# EAGLE design source_eagle (EAGLE 9.6.2)
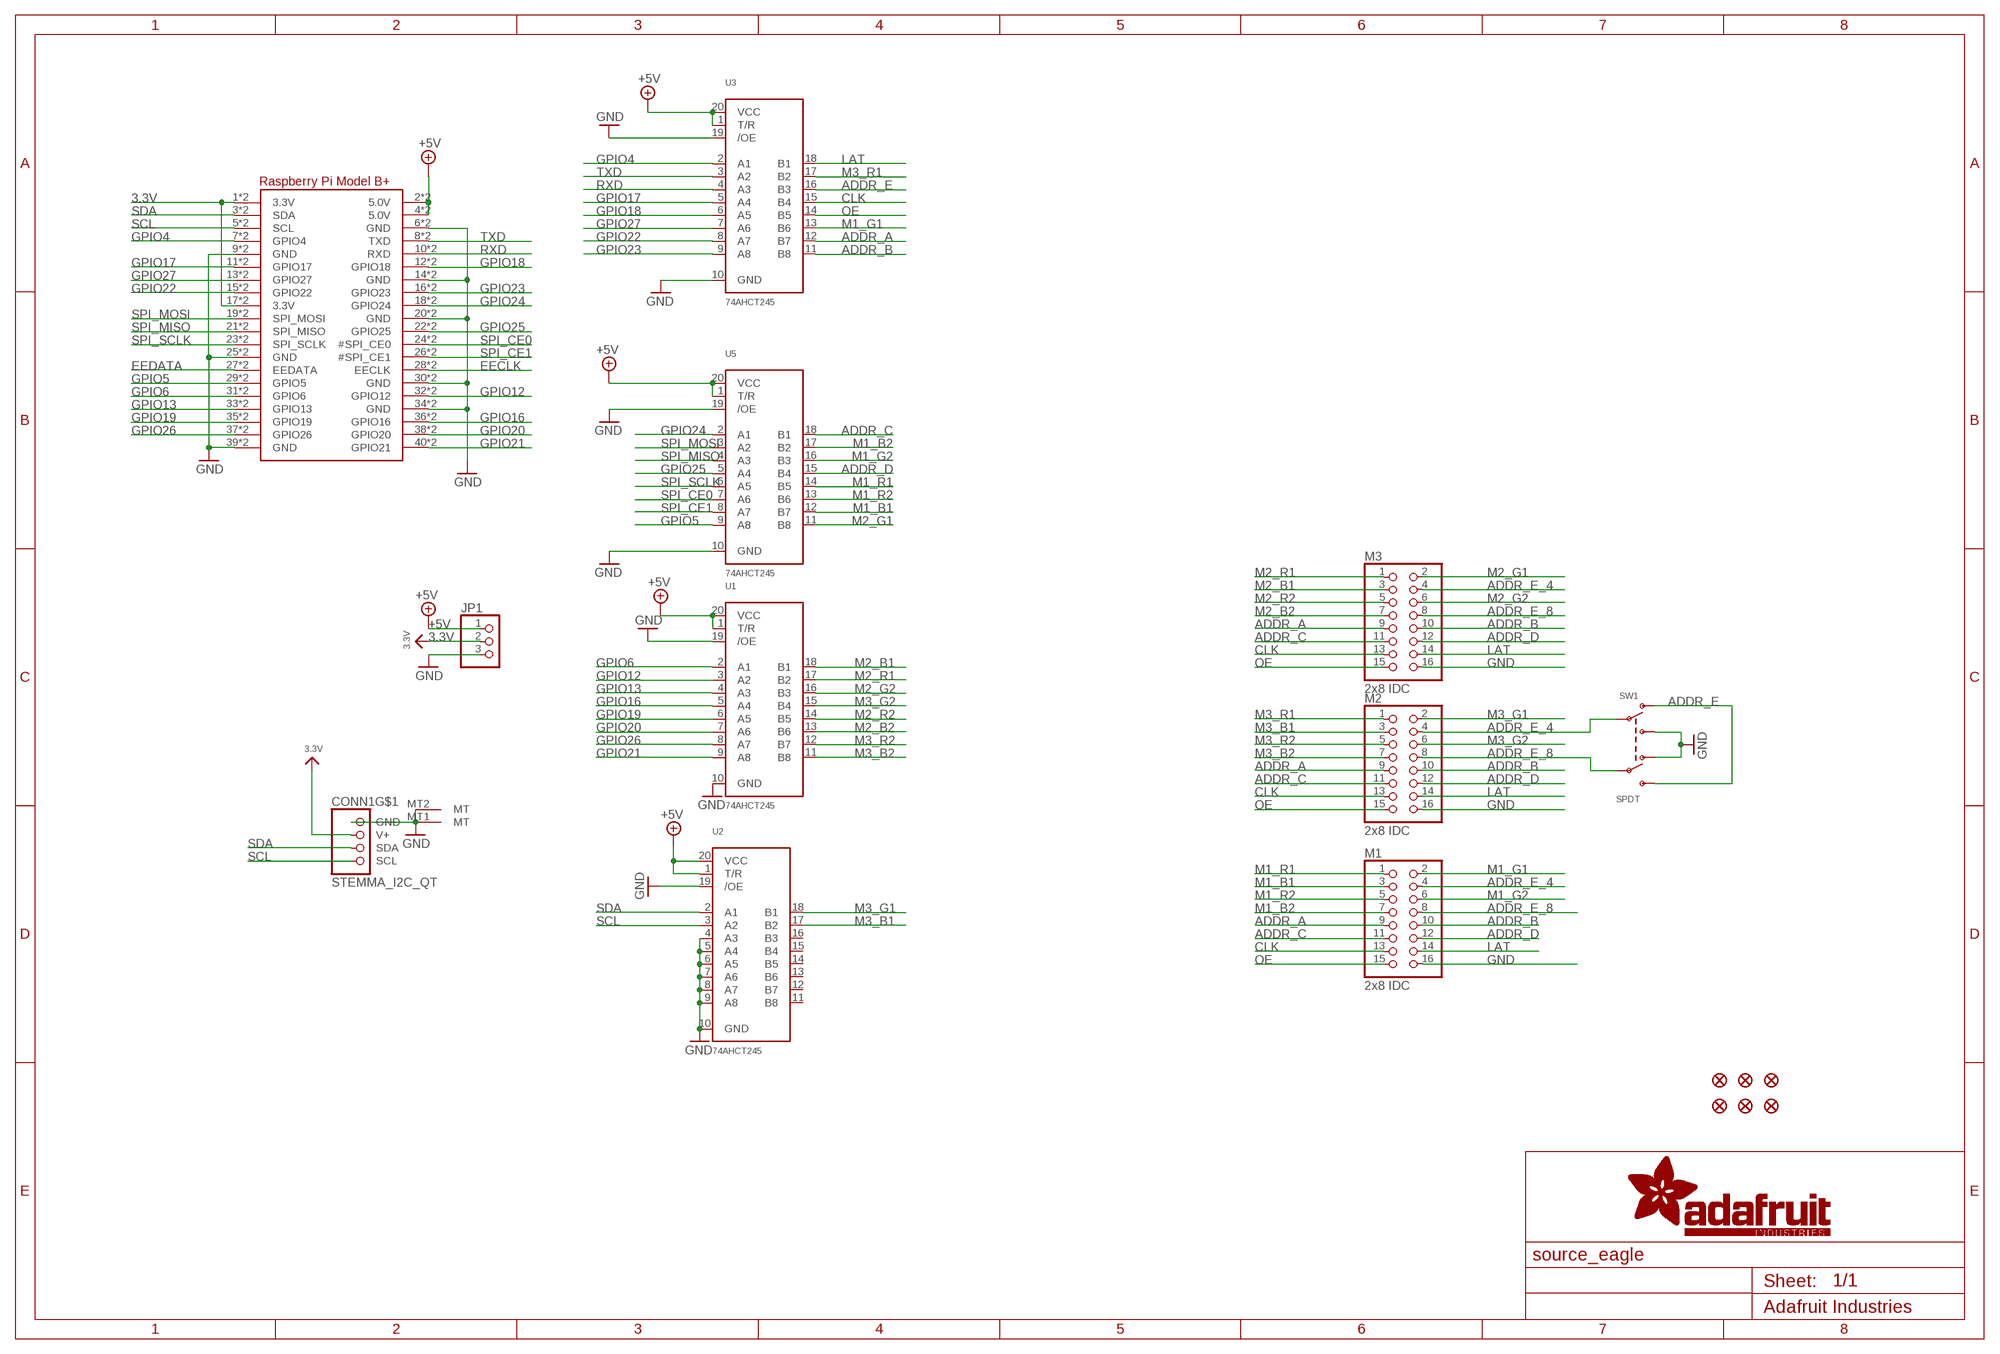
[diagram p0: schematic, sheet 1]

## Parts
CONN1  STEMMA_I2C_QT  [JST_SH4]
FID1  FIDUCIAL_1MM  [FIDUCIAL_1MM]
FID2  FIDUCIAL_1MM  [FIDUCIAL_1MM]
FID3  FIDUCIAL_1MM  [FIDUCIAL_1MM]
FID4  FIDUCIAL_1MM  [FIDUCIAL_1MM]
FID5  FIDUCIAL_1MM  [FIDUCIAL_1MM]
FID6  FIDUCIAL_1MM  [FIDUCIAL_1MM]
JP1  HEADER-1X376MIL  [1X03_ROUND_76]
M1  2x8 IDC  HEADER-2X8_SHROUDED  [2X08_SHROUDED]
M2  2x8 IDC  HEADER-2X8_SHROUDED  [2X08_SHROUDED]
M3  2x8 IDC  HEADER-2X8_SHROUDED  [2X08_SHROUDED]
RPI1  RASPBERRYPI_BPLUS_2X20_THMSMT  [RASPI_2X20_THMSMT]
SW1  SPDT  SWITCH_DPDTEG1390  [EG1390]
U1  74AHCT245  74LCX245_TSSOP20  [TSSOP20]
U2  74AHCT245  74LCX245_TSSOP20  [TSSOP20]
U3  74AHCT245  74LCX245_TSSOP20  [TSSOP20]
U5  74AHCT245  74LCX245_TSSOP20  [TSSOP20]

## Nets
3.3V: CONN1.2(V+) JP1.2 RPI1.1(3.3V) RPI1.17(3.3V) RPI1.S1(3.3V) RPI1.S17(3.3V)
+5V: JP1.1 RPI1.2(5.0V) RPI1.4(5.0V) RPI1.S2(5.0V) RPI1.S4(5.0V) U1.1(T/R) U1.20(VCC) U2.1(T/R) U2.20(VCC) U3.1(T/R) U3.20(VCC) U5.1(T/R) U5.20(VCC)
ADDR_A: M1.9 M2.9 M3.9 U3.12(B7)
ADDR_B: M1.10 M2.10 M3.10 U3.11(B8)
ADDR_C: M1.11 M2.11 M3.11 U5.18(B1)
ADDR_D: M1.12 M2.12 M3.12 U5.15(B4)
ADDR_E: SW1.O1 SW1.S2 U3.16(B3)
ADDR_E_4: M1.4 M2.4 M3.4 SW1.P1
ADDR_E_8: M1.8 M2.8 M3.8 SW1.P2
CLK: M1.13 M2.13 M3.13 U3.15(B4)
EECLK: RPI1.28(EECLK) RPI1.S28(EECLK)
EEDATA: RPI1.27(EEDATA) RPI1.S27(EEDATA)
GND: CONN1.1(GND) CONN1.MT1(MT) CONN1.MT2(MT) JP1.3 M1.16 M2.16 M3.16 RPI1.6(GND) RPI1.9(GND) RPI1.14(GND) RPI1.20(GND) RPI1.25(GND) RPI1.30(GND) RPI1.34(GND) RPI1.39(GND) RPI1.S6(GND) RPI1.S9(GND) RPI1.S14(GND) RPI1.S20(GND) RPI1.S25(GND) RPI1.S30(GND) RPI1.S34(GND) RPI1.S39(GND) SW1.O2 SW1.S1 U1.10(GND) U1.19(/OE) U2.4(A3) U2.5(A4) U2.6(A5) U2.7(A6) U2.8(A7) U2.9(A8) U2.10(GND) U2.19(/OE) U3.10(GND) U3.19(/OE) U5.10(GND) U5.19(/OE)
GPIO4: RPI1.7(GPIO4) RPI1.S7(GPIO4) U3.2(A1)
GPIO5: RPI1.29(GPIO5) RPI1.S29(GPIO5) U5.9(A8)
GPIO6: RPI1.31(GPIO6) RPI1.S31(GPIO6) U1.2(A1)
GPIO12: RPI1.32(GPIO12) RPI1.S32(GPIO12) U1.3(A2)
GPIO13: RPI1.33(GPIO13) RPI1.S33(GPIO13) U1.4(A3)
GPIO16: RPI1.36(GPIO16) RPI1.S36(GPIO16) U1.5(A4)
GPIO17: RPI1.11(GPIO17) RPI1.S11(GPIO17) U3.5(A4)
GPIO18: RPI1.12(GPIO18) RPI1.S12(GPIO18) U3.6(A5)
GPIO19: RPI1.35(GPIO19) RPI1.S35(GPIO19) U1.6(A5)
GPIO20: RPI1.38(GPIO20) RPI1.S38(GPIO20) U1.7(A6)
GPIO21: RPI1.40(GPIO21) RPI1.S40(GPIO21) U1.9(A8)
GPIO22: RPI1.15(GPIO22) RPI1.S15(GPIO22) U3.8(A7)
GPIO23: RPI1.16(GPIO23) RPI1.S16(GPIO23) U3.9(A8)
GPIO24: RPI1.18(GPIO24) RPI1.S18(GPIO24) U5.2(A1)
GPIO25: RPI1.22(GPIO25) RPI1.S22(GPIO25) U5.5(A4)
GPIO26: RPI1.37(GPIO26) RPI1.S37(GPIO26) U1.8(A7)
GPIO27: RPI1.13(GPIO27) RPI1.S13(GPIO27) U3.7(A6)
LAT: M1.14 M2.14 M3.14 U3.18(B1)
M1_B1: M1.3 U5.12(B7)
M1_B2: M1.7 U5.17(B2)
M1_G1: M1.2 U3.13(B6)
M1_G2: M1.6 U5.16(B3)
M1_R1: M1.1 U5.14(B5)
M1_R2: M1.5 U5.13(B6)
M2_B1: M3.3 U1.18(B1)
M2_B2: M3.7 U1.13(B6)
M2_G1: M3.2 U5.11(B8)
M2_G2: M3.6 U1.16(B3)
M2_R1: M3.1 U1.17(B2)
M2_R2: M3.5 U1.14(B5)
M3_B1: M2.3 U2.17(B2)
M3_B2: M2.7 U1.11(B8)
M3_G1: M2.2 U2.18(B1)
M3_G2: M2.6 U1.15(B4)
M3_R1: M2.1 U3.17(B2)
M3_R2: M2.5 U1.12(B7)
OE: M1.15 M2.15 M3.15 U3.14(B5)
RXD: RPI1.10(RXD) RPI1.S10(RXD) U3.4(A3)
SCL: CONN1.4(SCL) RPI1.5(SCL) RPI1.S5(SCL) U2.3(A2)
SDA: CONN1.3(SDA) RPI1.3(SDA) RPI1.S3(SDA) U2.2(A1)
SPI_CE0: RPI1.24(#SPI_CE0) RPI1.S24(#SPI_CE0) U5.7(A6)
SPI_CE1: RPI1.26(#SPI_CE1) RPI1.S26(#SPI_CE1) U5.8(A7)
SPI_MISO: RPI1.21(SPI_MISO) RPI1.S21(SPI_MISO) U5.4(A3)
SPI_MOSI: RPI1.19(SPI_MOSI) RPI1.S19(SPI_MOSI) U5.3(A2)
SPI_SCLK: RPI1.23(SPI_SCLK) RPI1.S23(SPI_SCLK) U5.6(A5)
TXD: RPI1.8(TXD) RPI1.S8(TXD) U3.3(A2)
Unconnected: U2.11(B8) U2.12(B7) U2.13(B6) U2.14(B5) U2.15(B4) U2.16(B3)

## Library data of the parts
CONN1 = adafruit_electromech:STEMMA_I2C; LCSC: C2845363
FID1-FID6 = microbuilder:FIDUCIAL: Fiducial Alignment Points Various fiducial points for machine vision alignment.; BOM: EXCLUDE
JP1 = microbuilder:HEADER-1X3: PIN HEADER
M1-M3 = microbuilder:HEADER-2X8
RPI1 = adafruit_sbc:RASPBERRYPI_BPLUS
SW1 = adafruit_electromech:SWITCH_DPDT: Switch - DPDT A DPDT Switch acts like an SPDT switch, but has a pair of switches instead of just one. Vertical - 0.3A @ 6V SMT - Digikey: JS202011SCQN; LCSC: C2837066
U1-U3 U5 = microbuilder:74LCX245: 74LCX245MTC - 5.0V Tolerant Bi-Directional Buffer Can be used to interface 5.0V logic to 2.5 or 3.3V devices Digikey: 74LCX245MTCXTR-ND Mouser: 512-74LCX245MTCX

## Board
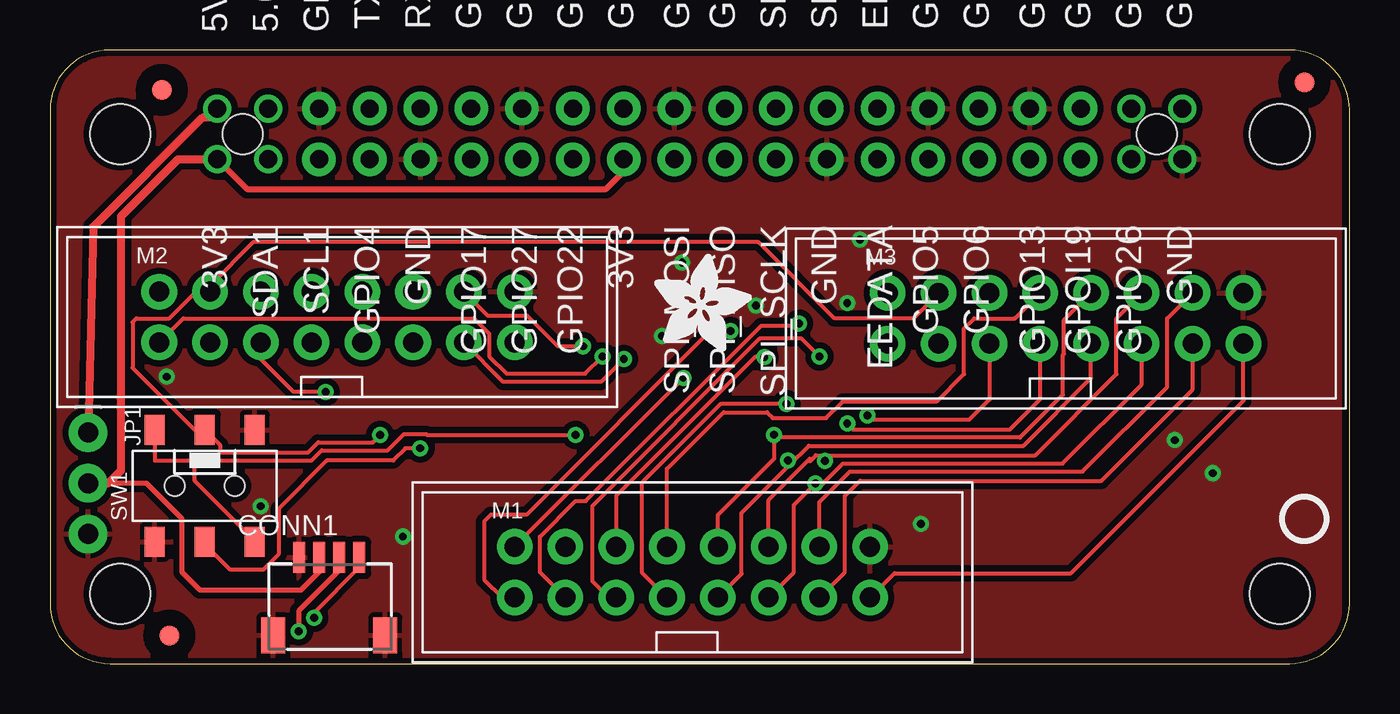
[diagram p1: board, top side]
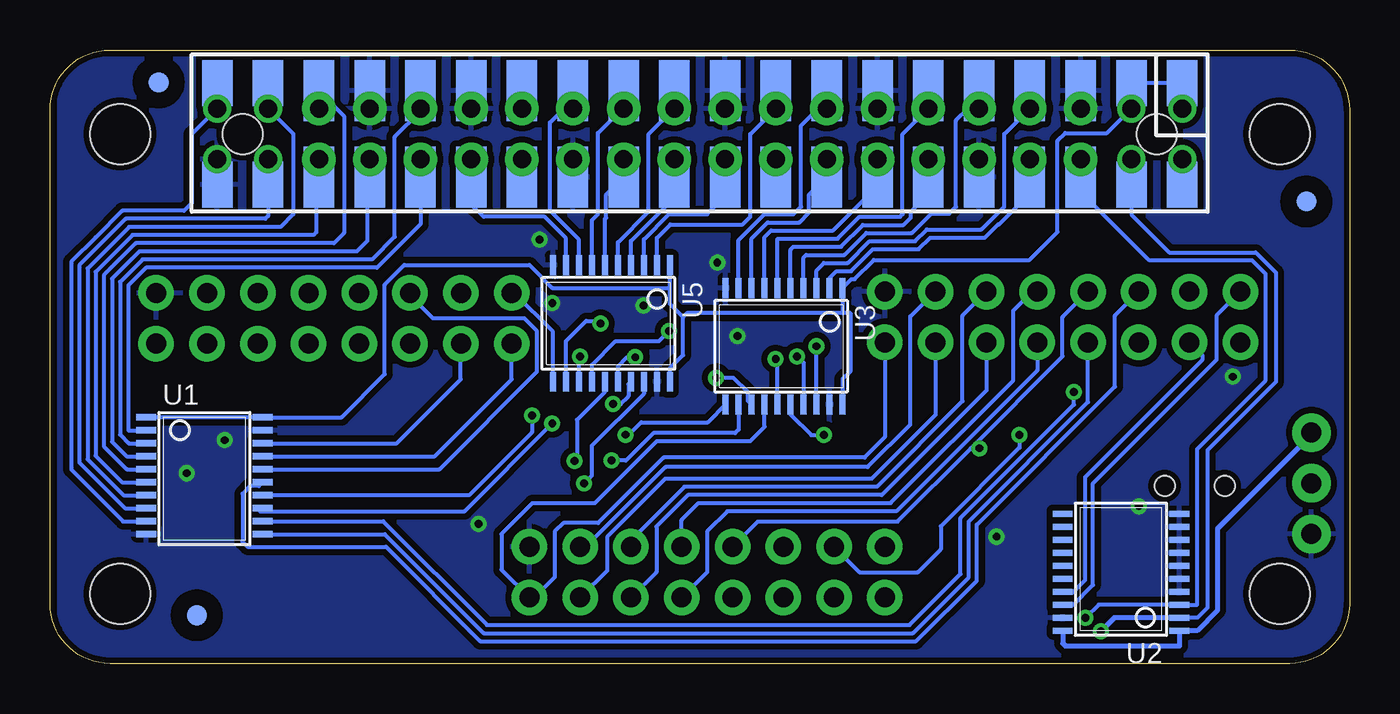
[diagram p2: board, bottom side, seen from below]

Size 65 x 30.7 mm. Coordinates in mm from the lower left corner, seen from the top.
Outline: 0,27.7 0,3 arc90 3,0 62,0 arc90 65,3 65,27.7 arc90 62,30.7 3,30.7 arc90 0,27.7
Copper layers (1*16): Top 0.035mm / dielectric 1.5mm / Bottom 0.035mm
Design rules "adafruit 8-8": minimum track width 6mil, minimum drill 15.5mil, track to track 8mil, track to pad 8mil, pad to pad 8mil, via to via 8mil, smd to smd 8mil, copper to edge 10mil, drill to drill 8mil, minimum pad ring 10mil, minimum via ring 8mil, stop-mask expansion 2mil, vias tented up to drill 20mil, thermal gap 10mil
Holes 3 mm at 3.5,26.5 61.5,26.5 61.5,3.5 3.5,3.5

### Footprints (pad centres in the part's own frame; a part is rotated, then mirrored left to right if it is on the bottom)
JST_SH4 = smd 0.6 x 1.55: 1 -1.5,2.006; 2 -0.5,2.006; 3 0.5,2.006; 4 1.5,2.006 | smd 1.2 x 1.8: MT1 -2.8,-1.894; MT2 2.8,-1.894
FIDUCIAL_1MM = smd 1 x 1: 1 0,0
1X03_ROUND_76 = drill 1 pad 1.93: 1 -2.54,0; 2 0,0; 3 2.54,0
2X08_SHROUDED = drill 1 pad 1.778: 1 -8.89,-1.27; 2 -8.89,1.27; 3 -6.35,-1.27; 4 -6.35,1.27; 5 -3.81,-1.27; 6 -3.81,1.27; 7 -1.27,-1.27; 8 -1.27,1.27; 9 1.27,-1.27; 10 1.27,1.27; 11 3.81,-1.27; 12 3.81,1.27; 13 6.35,-1.27; 14 6.35,1.27; 15 8.89,-1.27; 16 8.89,1.27
RASPI_2X20_THMSMT = drill 0.9 pad 1.27: 1 -24.13,-1.27; 2 -24.13,1.27; 3 -21.59,-1.27; 4 -21.59,1.27; 37 21.59,-1.27; 38 21.59,1.27; 39 24.13,-1.27; 40 24.13,1.27 | drill 0.9 pad 1.676: 5 -19.05,-1.27; 6 -19.05,1.27; 7 -16.51,-1.27; 8 -16.51,1.27; 9 -13.97,-1.27; 10 -13.97,1.27; 11 -11.43,-1.27; 12 -11.43,1.27; 13 -8.89,-1.27; 14 -8.89,1.27; 15 -6.35,-1.27; 16 -6.35,1.27; 17 -3.81,-1.27; 18 -3.81,1.27; 19 -1.27,-1.27; 20 -1.27,1.27; 21 1.27,-1.27; 22 1.27,1.27; 23 3.81,-1.27; 24 3.81,1.27; 25 6.35,-1.27; 26 6.35,1.27; 27 8.89,-1.27; 28 8.89,1.27; 29 11.43,-1.27; 30 11.43,1.27; 31 13.97,-1.27; 32 13.97,1.27; 33 16.51,-1.27; 34 16.51,1.27; 35 19.05,-1.27; 36 19.05,1.27 | smd 1.524 x 2.286 bottom: S1 -24.13,-2.542; S2 -24.13,2.538; S3 -21.59,-2.542; S4 -21.59,2.538; S37 21.59,-2.542; S38 21.59,2.538; S39 24.13,-2.542; S40 24.13,2.538 | smd 1.524 x 3.048 bottom: S5 -19.05,-2.161; S6 -19.05,2.157; S7 -16.51,-2.161; S8 -16.51,2.157; S9 -13.97,-2.161; S10 -13.97,2.157; S11 -11.43,-2.161; S12 -11.43,2.157; S13 -8.89,-2.161; S14 -8.89,2.157; S15 -6.35,-2.161; S16 -6.35,2.157; S17 -3.81,-2.161; S18 -3.81,2.157; S19 -1.27,-2.161; S20 -1.27,2.157; S21 1.27,-2.161; S22 1.27,2.157; S23 3.81,-2.161; S24 3.81,2.157; S25 6.35,-2.161; S26 6.35,2.157; S27 8.89,-2.161; S28 8.89,2.157; S29 11.43,-2.161; S30 11.43,2.157; S31 13.97,-2.161; S32 13.97,2.157; S33 16.51,-2.161; S34 16.51,2.157; S35 19.05,-2.161; S36 19.05,2.157 | hole 2: 22.86,0; -22.86,0
EG1390 = smd 1 x 1.5: O1 -2.5,2.8; O2 -2.5,-2.8; P1 0,2.8; P2 0,-2.8; S1 2.5,2.8; S2 2.5,-2.8 | hole 1: 1.5,0; -1.5,0
TSSOP20 = smd 0.305 x 0.991: 1 -2.925,-2.918; 2 -2.275,-2.918; 3 -1.625,-2.918; 4 -0.975,-2.918; 5 -0.325,-2.918; 6 0.325,-2.918; 7 0.975,-2.918; 8 1.625,-2.918; 9 2.275,-2.918; 10 2.925,-2.918; 11 2.925,2.918; 12 2.275,2.918; 13 1.625,2.918; 14 0.975,2.918; 15 0.325,2.918; 16 -0.325,2.918; 17 -0.975,2.918; 18 -1.625,2.918; 19 -2.275,2.918; 20 -2.925,2.918

### Placement (x,y rotation side)
CONN1  13.97,3.3 0 top
FID1  5.59,28.7 0 top
FID2  5.97,1.4 0 top
FID3  62.74,29.08 0 top
FID4  2.16,23.11 0 bottom
FID5  59.56,29.08 0 bottom
FID6  57.66,2.41 0 bottom
JP1  1.91,9.02 270 top
M1  32.13,4.57 0 top
M2  14.35,17.34 0 top
M3  50.8,17.27 0 top
PLABEL0  [PLABEL0]  31.5,10.54 0 top
PLABEL1  [PLABEL1]  5.08,22.99 0 top
PLABEL2  [PLABEL2]  60.07,23.11 0 top
PLABEL3  [PLABEL3]  3.68,11.56 0 top
PLABEL4  [PLABEL4]  3.56,9.02 0 top
PLABEL5  [PLABEL5]  3.68,6.48 0 top
PLABEL6  [PLABEL6]  46.74,4.57 0 top
PLABEL7  [PLABEL7]  11.68,9.02 0 top
PLABEL8  [PLABEL8]  8.38,4.95 0 top
PLABEL9  [PLABEL9]  5.84,4.95 0 top
PLABEL10  [PLABEL10]  9.4,0.13 90 top
PLABEL11  [PLABEL11]  5.84,19.68 90 bottom
PLABEL12  [PLABEL12]  8,19.68 90 bottom
PLABEL13  [PLABEL13]  10.54,19.68 90 bottom
PLABEL14  [PLABEL14]  13.08,19.68 90 bottom
PLABEL15  [PLABEL15]  15.62,19.68 90 bottom
PLABEL16  [PLABEL16]  18.16,19.68 90 bottom
PLABEL17  [PLABEL17]  20.7,19.68 90 bottom
PLABEL18  [PLABEL18]  23.24,19.56 90 bottom
PLABEL19  [PLABEL19]  23.24,14.99 90 bottom
PLABEL20  [PLABEL20]  20.7,14.99 90 bottom
PLABEL21  [PLABEL21]  18.16,14.99 90 bottom
PLABEL22  [PLABEL22]  15.62,14.99 90 bottom
PLABEL23  [PLABEL23]  13.08,14.99 90 bottom
PLABEL24  [PLABEL24]  10.54,14.99 90 bottom
PLABEL25  [PLABEL25]  8,14.99 90 bottom
PLABEL26  [PLABEL26]  5.08,14.99 90 bottom
PLABEL27  [PLABEL27]  41.91,19.68 90 bottom
PLABEL28  [PLABEL28]  44.45,19.68 90 bottom
PLABEL29  [PLABEL29]  46.99,19.68 90 bottom
PLABEL30  [PLABEL30]  49.53,19.68 90 bottom
PLABEL31  [PLABEL31]  52.07,19.68 90 bottom
PLABEL32  [PLABEL32]  54.61,19.68 90 bottom
PLABEL33  [PLABEL33]  57.15,19.68 90 bottom
PLABEL34  [PLABEL34]  59.69,19.68 90 bottom
PLABEL35  [PLABEL35]  59.31,14.48 0 bottom
PLABEL36  [PLABEL36]  55.88,14.48 0 bottom
PLABEL37  [PLABEL37]  54.1,14.48 0 bottom
PLABEL38  [PLABEL38]  52.07,14.86 90 bottom
PLABEL39  [PLABEL39]  49.53,14.86 90 bottom
PLABEL40  [PLABEL40]  46.99,14.86 90 bottom
PLABEL41  [PLABEL41]  44.45,14.86 90 bottom
PLABEL42  [PLABEL42]  41.91,14.86 90 bottom
PLABEL43  [PLABEL43]  40.13,1.78 0 bottom
PLABEL44  [PLABEL44]  37.08,1.78 0 bottom
PLABEL45  [PLABEL45]  35.43,1.78 0 bottom
PLABEL46  [PLABEL46]  32.89,1.78 0 bottom
PLABEL47  [PLABEL47]  30.73,1.78 0 bottom
PLABEL48  [PLABEL48]  28.32,1.78 0 bottom
PLABEL49  [PLABEL49]  25.78,1.78 0 bottom
PLABEL50  [PLABEL50]  23.24,1.78 0 bottom
PLABEL51  [PLABEL51]  23.24,6.99 90 bottom
PLABEL52  [PLABEL52]  25.78,6.99 90 bottom
PLABEL53  [PLABEL53]  28.32,6.99 90 bottom
PLABEL54  [PLABEL54]  30.86,6.99 90 bottom
PLABEL55  [PLABEL55]  33.4,6.99 90 bottom
PLABEL56  [PLABEL56]  35.94,6.99 90 bottom
PLABEL57  [PLABEL57]  38.48,6.99 90 bottom
PLABEL58  [PLABEL58]  41.02,6.99 90 bottom
PLABEL59  [PLABEL59]  53.34,4.32 0 bottom
PLABEL60  [PLABEL60]  21.59,2.54 0 bottom
PLABEL61  [PLABEL61]  30.73,0.64 0 bottom
PLABEL62  [PLABEL62]  28.32,0.64 0 bottom
PLABEL63  [PLABEL63]  25.78,0.64 0 bottom
PLABEL64  [PLABEL64]  23.24,0.64 0 bottom
RPI1  32.5,26.5 0 top
SW1  7.75,8.89 0 top
U1  57.28,9.4 270 bottom
U2  11.43,4.57 90 bottom
U3  28.28,15.88 180 bottom
U5  36.92,17.02 180 bottom
U$2  [ADAFRUIT_5MM]  30.23,15.62 0 top
U$3  [PCBFEAT-REV-056]  62.74,7.24 0 top

### Tracks (layer width: path | path; a pad name or v marks a point on that pad's centre or on a via)
3.3V
  Top 0.254: 2.92,9.02 4.83,9.02 6.6,7.24 6.6,4.57 7.49,3.68 12.57,3.68 13.47,4.58 CONN1.2
  Top 0.305: RPI1.1 9.85,23.75 27.81,23.75 28.7,24.64 28.7,25.22 RPI1.17
  Top 0.406: JP1.2 2.92,9.02 3.56,9.65 3.56,22.38 6.41,25.23 RPI1.1
  Bottom 0.406: RPI1.S1 RPI1.1 | RPI1.S17 RPI1.17 | RPI1.17
+5V
  Top 0.406: RPI1.2 8.38,27.76 8.38,27.3 7.62,27.3 2.16,21.84 JP1.1
  Bottom 0.203: 54.74,12.32 59.94,12.32 | U5.20 33.99,14.78 33.33,15.44 33.33,17.33 33.34,17.34 | 33.99,18.8 33.99,17.99 33.34,17.34 | 33.99,18.8 U5.1 | 25.36,17.53 U3.1 24.92,19.23 24.76,19.23 23.8,20.19 16,20.19 14.61,21.59 14.61,26.16 14.22,26.54 12.14,26.54 RPI1.4 10.91,27.81 | U3.20 25.36,14.23 24.97,14.61 24.97,17.53 25.36,17.53 | 25.36,17.53 33.15,17.53 33.34,17.34 | RPI1.S2 RPI1.S4 | 8.37,27.81 RPI1.2 | RPI1.2 | 53.98,12.32 50.41,12.32 48.26,14.48 48.26,18.96 47.28,19.94 41.02,19.94 39.88,18.8 33.99,18.8
  Bottom 0.254: JP1.1 1.91,11.43 6.6,6.73 6.6,2.67 7.62,1.65 U2.1 | U2.1 | U2.1 8.51,0.89 14.22,0.89 14.35,1.01 U2.20 | 53.98,12.32 U1.20 54.74,12.32 | U1.1 59.94,12.32
  Bottom 0.406: RPI1.S4 | RPI1.S4 10.91,27.81 | RPI1.S2 8.37,27.81
ADDR_A  (via drill 0.39)
  Top 0.203: M1.9 34.59,4.5 34.59,7.54 37.02,9.97 | M3.9 52.07,14.28 48.68,10.9 37.95,10.9 37.02,9.97 | v36.92,10.16 36.92,10.07 37.02,9.97
  Bottom 0.203: M2.9 15.62,14.67 22.67,7.62 31.11,7.62 32.13,6.6 32.13,4.57 M1.9 | U3.12 30.55,11.71 30.73,11.53 34.81,11.53 36.19,10.16 v36.92,10.16
ADDR_B  (via drill 0.39)
  Top 0.203: M1.10 33.4,7.43 36.21,10.24 v36.21,11.45 36.36,11.3 48.51,11.3 50.67,13.46 50.67,15.46 50.72,15.51 50.72,17.2 M3.10
  Bottom 0.203: M1.10 33.4,7.18 32.55,8.03 22.96,8.03 16.82,14.17 16.82,17.65 15.86,18.61 M2.10 | U3.11 32.09,12.07 35.43,12.07 36.21,11.28 v36.21,11.45
ADDR_C  (via drill 0.39)
  Top 0.203: M1.11 37.21,4.57 37.21,7.93 v38.28,9.01 38.66,9.01 39.66,10.01 50.65,10.01 54.61,13.97 M3.11
  Bottom 0.203: M2.11 18.16,13.66 23.39,8.43 33.1,8.43 34.67,6.86 34.67,4.57 M1.11 | U5.18 35.29,13.5 37.9,10.88 37.9,9.39 v38.28,9.01
ADDR_D  (via drill 0.39)
  Top 0.203: M1.12 35.94,8.18 38.01,10.25 38.01,10.12 38.3,10.41 38.76,10.41 | M3.12 53.34,17.27 53.34,14.48 49.28,10.41 38.76,10.41 | v38.76,10.14 38.76,10.41
  Bottom 0.203: M1.12 35.94,6.16 33.27,8.84 23.65,8.84 19.36,13.13 19.36,17.41 M2.12 | v38.76,10.14 38.64,10.26 38.64,12.2 37.24,13.59 U5.15
ADDR_E  (via drill 0.39)
  Top 0.203: SW1.O1 5.25,10.16 7.37,10.16 | 7.37,10.16 13.08,10.16 13.59,10.67 16.89,10.67 17.7,11.48 18.81,11.48 18.86,11.43 v26.29,11.43 | SW1.S2 10.25,6.14 7.24,9.14 7.24,10.03 7.37,10.16
  Bottom 0.203: U3.16 27.96,12.46 26.92,11.43 v26.29,11.43
ADDR_E_4  (via drill 0.39)
  Top 0.203: M3.4 43.18,17.27 39.24,17.27 35.43,21.08 10.16,21.08 8,18.92 M2.4 7.3,18.61 5.97,17.27 4.32,17.27 4.13,17.08 4.13,14.8 7.23,11.69 SW1.P1 8.51,10.93 8.51,10.57 12.91,10.57 13.42,11.07 16.15,11.07 v16.51,11.43
  Bottom 0.203: M1.4 24.51,4.57 21.59,4.57 20.45,5.71 20.45,6.86 16.51,10.8 v16.51,11.43
ADDR_E_8  (via drill 0.39)
  Top 0.203: M3.8 48.26,17.27 46.23,17.27 45.72,16.76 45.72,14.48 44.36,13.12 39.66,13.12 38.82,12.28 36.16,12.28 35.87,12.57 33.69,12.57 30.86,9.74 M1.8 | v18.52,10.77 17.78,10.77 17.17,10.16 13.84,10.16 11.43,7.75 11.43,5.46 10.67,4.7 9.02,4.7 7.75,5.97 SW1.P2
  Bottom 0.203: M1.8 29.59,7.11 22.61,7.11 18.94,10.77 | 18.94,10.77 14.35,15.37 14.35,17.34 M2.8 | v18.52,10.77 18.94,10.77
CLK  (via drill 0.39)
  Top 0.203: M1.13 39.75,4.57 39.75,8.38 40.51,9.14 52.58,9.14 57.15,13.72 M3.13 | v28.7,15.24 27.56,14.1 22.67,14.1 M2.13
  Bottom 0.203: M2.13 20.7,12.45 23.9,9.25 34.23,9.25 37.13,6.34 37.13,4.65 M1.13 | U3.15 28.61,15.14 v28.7,15.24
EECLK
  Bottom 0.406: RPI1.S28 | RPI1.S28 RPI1.28
EEDATA
  Bottom 0.406: RPI1.S27 RPI1.27 | RPI1.27
GND  (via drill 0.39)
  Bottom 0.406: RPI1.S30 | RPI1.S30 RPI1.30
  other vias: 31.62,20.07 30.61,16.38 39.88,18.03 40.51,21.21 58.17,9.53 35.31,17.91 43.56,6.99 56.26,11.18 5.84,14.35 10.54,7.87 17.65,6.35
  pour Bottom (isolate 0.305): 0,30.73 0,0 64.52,0 64.52,30.73
  pour Top (isolate 0.305): 0,30.73 0,0 64.52,0 64.52,30.73
GPIO4
  Bottom 0.203: U3.2 26.01,19.28 25.65,19.63 24.93,19.63 23.84,20.73 21.56,20.73 20.97,21.31 18.25,21.31 17.59,21.97 17.53,21.97 16.13,23.37 16.13,24.2 RPI1.S7
  Bottom 0.406: RPI1.S7 RPI1.7 | RPI1.7
GPIO5
  Bottom 0.203: U5.9 39.19,21.29 40.26,22.35 43.31,22.35 43.93,22.98 RPI1.S29
  Bottom 0.406: RPI1.S29 RPI1.29 | RPI1.29
GPIO6
  Bottom 0.203: RPI1.S31 46.47,21.98 48.64,19.81 60.2,19.81 61.09,18.92 61.09,11.68 61.08,11.67 U1.2
  Bottom 0.406: RPI1.S31 RPI1.31 | RPI1.31
GPIO12
  Bottom 0.203: 60.45,11.02 61.06,11.02 61.49,11.46 61.49,19.09 60.37,20.22 48.9,20.22 47.75,21.36 47.75,26.36 46.47,27.64 RPI1.32 RPI1.S32 | RPI1.S32
  Bottom 0.254: U1.3 | U1.3 60.45,11.02
GPIO13
  Bottom 0.203: RPI1.S33 49.01,24.09 49.14,23.96 49.14,21.14 49.66,20.62 60.53,20.62 61.9,19.26 61.9,11.1 61.17,10.37 U1.4
  Bottom 0.406: RPI1.S33 RPI1.33 | RPI1.33
GPIO16
  Bottom 0.203: RPI1.S36 50.29,27.4 50.29,21.54 50.8,21.03 60.7,21.03 62.31,19.43 62.31,10.87 61.16,9.72 U1.5
  Bottom 0.406: RPI1.S36 RPI1.36 | RPI1.36
GPIO17
  Bottom 0.203: U3.5 27.96,20.71 27.81,20.85 25.43,20.85 24.34,21.95 22.31,21.95 21.95,22.31 21.95,22.62 21.07,23.5 RPI1.S11
  Bottom 0.406: RPI1.11 | RPI1.S11 RPI1.11
GPIO18
  Bottom 0.203: U3.6 28.61,21.26 25.6,21.26 24.51,22.35 22.48,22.35 22.35,22.48 22.35,26.49 RPI1.12
  Bottom 0.406: RPI1.S12 | RPI1.S12 RPI1.12
GPIO19
  Bottom 0.203: RPI1.S35 51.55,24.09 51.68,23.96 51.68,21.58 51.82,21.44 60.87,21.44 62.71,19.6 62.71,10.39 61.4,9.07 U1.6
  Bottom 0.406: RPI1.S35 RPI1.35 | RPI1.35
GPIO20
  Bottom 0.203: RPI1.38 52.83,26.51 52.83,22.48 53.47,21.84 61.04,21.84 63.12,19.77 63.12,10.22 61.32,8.42 U1.7
  Bottom 0.406: RPI1.S38 RPI1.38 | RPI1.38
GPIO21
  Bottom 0.203: RPI1.40 57.91,26.49 57.91,23.04 58.29,22.66 61.38,22.66 62.72,21.32 63.93,20.1 63.93,9.7 61.34,7.11 60.21,7.11 U1.9
  Bottom 0.406: RPI1.S40 RPI1.40 | RPI1.40
GPIO22
  Bottom 0.203: U3.8 29.91,21.27 29.1,22.07 27.52,22.07 27.03,22.57 27.03,23.46 RPI1.S15
  Bottom 0.406: RPI1.S15 RPI1.15 | RPI1.15
GPIO23
  Bottom 0.203: U3.9 30.55,21.19 29.27,22.48 27.81,22.48 27.43,22.86 27.43,26.92 26.59,27.77 RPI1.16
  Bottom 0.406: RPI1.S16 | RPI1.S16 RPI1.16
GPIO24
  Bottom 0.203: U5.2 34.64,21.29 33.96,21.97 30.35,21.97 29.97,22.35 29.97,26.49 RPI1.18
  Bottom 0.406: RPI1.S18 | RPI1.S18 RPI1.18
GPIO25
  Bottom 0.203: U5.5 36.59,21.07 35.05,22.61 35.05,26.49 RPI1.22
  Bottom 0.406: RPI1.S22 | RPI1.S22 RPI1.22
GPIO26
  Bottom 0.203: RPI1.S37 54.09,22.39 54.23,22.25 61.21,22.25 63.52,19.93 63.52,10.05 61.25,7.77 U1.8
  Bottom 0.406: RPI1.S37 RPI1.37 | RPI1.37
GPIO27
  Bottom 0.203: U3.7 29.26,21.34 28.93,21.67 25.83,21.67 23.88,23.62 23.88,24.07 RPI1.S13
  Bottom 0.406: RPI1.13 | RPI1.S13 RPI1.13
LAT  (via drill 0.39)
  Top 0.203: M1.14 38.48,8.08 40.01,9.6 51.64,9.6 55.88,13.84 55.88,17.27 M3.14 | v26.67,15.88 25.4,15.88 23.88,17.4 21.91,17.4 M2.14
  Bottom 0.203: M1.14 38.2,5.84 34.21,9.84 24.11,9.84 21.97,11.97 21.97,17.37 20.74,18.61 M2.14 | U3.18 26.67,12.97 v26.67,15.88
M1_B1  (via drill 0.39)
  Top 0.203: v37.47,17.01 37.34,16.89 35.55,16.89 26.8,8.13 26.29,8.13 24.51,6.35 24.51,4.57 M1.3
  Bottom 0.203: v37.47,17.01 37.59,17.14 38.19,17.14 39.19,16.13 U5.12
M1_B2  (via drill 0.39)
  Top 0.203: v36.83,12.98 33.53,12.98 29.59,9.04 29.59,4.57 M1.7
  Bottom 0.203: v36.83,12.98 36.45,12.98 36.07,13.37 36.07,13.36 36.07,13.97 U5.17
M1_G1  (via drill 0.39)
  Top 0.203: v31.68,14.3 23.24,5.86 M1.2
  Bottom 0.203: U3.13 30.1,13.15 30.1,13.58 30.82,14.3 v31.68,14.3
M1_G2  (via drill 0.39)
  Top 0.203: v35.73,15.33 35.27,15.33 28.32,8.38 M1.6
  Bottom 0.203: U5.16 36.59,14.86 36.13,15.33 v35.73,15.33
M1_R1  (via drill 0.39)
  Top 0.203: v34.04,16.64 33.02,16.64 23.82,7.44 22.05,7.44 21.72,7.11 21.72,4.19 22.61,3.3 M1.1
  Bottom 0.203: U5.14 37.89,14.94 36.7,16.13 34.54,16.13 v34.04,16.64
M1_R2  (via drill 0.39)
  Top 0.203: M1.5 27.94,3.3 27.13,4.12 27.13,7.88 35.5,16.26 37.59,16.26 v38.48,15.37
  Bottom 0.203: U5.13 38.54,15.31 v38.48,15.37
M2_B1
  Bottom 0.203: U1.18 47.65,11.02 44.45,14.22 M3.3
M2_B2  (via drill 0.39)
  Top 0.203: v39.88,12.01 40.18,11.71 48.01,11.71 49.53,13.23 M3.7
  Bottom 0.203: U1.13 54.51,7.62 44.27,7.62 v39.88,12.01
M2_G1
  Bottom 0.203: U5.11 39.84,16.6 41.78,18.54 M3.2
M2_G2
  Bottom 0.203: U1.16 45.52,9.72 40.64,14.61 40.64,16.64 41.27,17.27 45.85,17.27 46.99,18.41 M3.6
M2_R1
  Bottom 0.203: U1.17 45.76,10.37 41.91,14.22 M3.1
M2_R2  (via drill 0.39)
  Top 0.203: M3.5 46.99,13.21 45.97,12.19 41.12,12.19 v40.89,12.41
  Bottom 0.203: v40.89,12.41 40.89,11.57 44.04,8.42 U1.14
M3_B1
  Bottom 0.203: 14.22,3.56 13.84,3.56 13.23,4.17 13.23,9.31 7.37,15.18 7.37,15.43 M2.3
  Bottom 0.254: U2.17 14.31,3.56 14.22,3.56
M3_B2
  Bottom 0.203: U1.11 48.26,6.47 43.31,1.52 21.84,1.52 19.05,4.32 19.05,7.11 13.08,13.08 M2.7
M3_G1
  Bottom 0.203: U2.18 13.82,2.95 12.83,3.94 12.83,9.02 6.66,15.19 6.66,17.41 M2.2
M3_G2
  Bottom 0.203: U1.15 54.55,8.88 54.98,8.88 55.37,8.49 55.37,6.1 55.12,5.84 48.2,5.84 43.48,1.12 21.68,1.12 18.64,4.15 18.64,6.94 11.73,13.85 11.73,17.41 M2.6
M3_R1  (via drill 0.39)
  Top 0.203: M2.1 6.67,17.27 21.21,17.27 21.97,16.51 21.97,15.37 22.84,14.5 26.77,14.5 v27.63,15.37
  Bottom 0.203: v27.63,15.37 27.3,15.04 U3.17
M3_R2  (via drill 0.39)
  Top 0.203: v13.79,13.59 12.19,13.59 10.16,15.62 10.16,15.68 M2.5
  Bottom 0.203: U1.12 48.33,7.12 43.14,1.93 22.01,1.93 19.46,4.49 19.46,7.28 13.79,12.95 v13.79,13.59
OE
  Top 0.203: M1.15 42.24,4.52 51.07,4.52 59.69,13.14 M3.15
  Bottom 0.203: M2.15 23.24,11.33 24.26,10.31 34.31,10.31 37.59,7.04 39.32,7.04 39.75,6.6 39.75,4.32 40.77,3.3 M1.15 42.42,4.7 42.42,6.48 40.87,8.03 37.74,8.03 34.65,11.12 29.97,11.12 29.26,11.84 U3.14
RXD
  Bottom 0.203: U3.4 27.3,20.32 27.18,20.45 25.27,20.45 24.17,21.54 21.89,21.54 20.92,22.51 20.03,22.51 19.68,22.86 19.68,27.18 19.09,27.77 RPI1.10
  Bottom 0.406: RPI1.S10 | RPI1.S10 RPI1.10
SCL  (via drill 0.39)
  Top 0.203: CONN1.4 15.47,4.8 13.21,2.54 v13.21,2.29
  Bottom 0.203: v13.21,2.29 12.55,2.95 U2.3 7.62,2.95 7.62,10.73 4.19,14.16 4.19,19.49 4.87,20.17 10.01,20.17 13.59,23.75 13.59,24.2 RPI1.S5
  Bottom 0.406: RPI1.S5 RPI1.5 | RPI1.5
SDA  (via drill 0.39)
  Top 0.254: CONN1.3 14.47,4.66 12.45,2.63 v12.45,1.61
  Bottom 0.203: RPI1.S3 10.91,22.47 9.02,20.57 4.7,20.57 3.68,19.56 3.68,14.1 7.11,10.67 7.11,2.79 7.61,2.3 U2.2
  Bottom 0.254: U2.2 11.76,2.3 v12.45,1.61
  Bottom 0.406: RPI1.S3 RPI1.3
SPI_CE0
  Bottom 0.203: U5.7 37.89,22.18 37.59,22.48 37.59,26.54 36.37,27.77 RPI1.24
  Bottom 0.406: RPI1.S24 36.37,28.6 36.37,27.77
SPI_CE1
  Bottom 0.203: U5.8 38.54,21.21 39.99,22.66 39.99,27.06 39.29,27.77 RPI1.26 RPI1.S26 | RPI1.S26
SPI_MISO
  Bottom 0.203: U5.4 35.94,21.14 33.77,23.31 RPI1.S21
  Bottom 0.406: RPI1.S21 RPI1.21 | RPI1.21
SPI_MOSI
  Bottom 0.203: U5.3 35.29,21.22 34.03,22.48 32.13,22.48 31.24,23.37 31.24,24.33 RPI1.S19
  Bottom 0.406: RPI1.S19 RPI1.19 | RPI1.19
SPI_SCLK
  Bottom 0.203: U5.6 37.24,22.25 37.19,22.31 37.19,23.46 RPI1.S23
  Bottom 0.406: RPI1.S23 RPI1.23 | RPI1.23
TXD
  Bottom 0.203: U3.3 26.66,19.67 26.29,20.04 25.1,20.04 24.01,21.13 21.73,21.13 21.14,21.72 18.41,21.72 17.27,22.86 17.27,26.49 RPI1.8
  Bottom 0.406: RPI1.S8 | RPI1.S8 RPI1.8

### Text on the board
tDocu: SDA | SCL | CLK | CE1 | TX | RX | 4 | 17 | 18 | 27 | 22 | 23 | 24 | 25 | MO | MI | CE0 | 5 | 6 | 12 | 13 | 16 | 19 | 20 | 21 | 5V | GND | OE | CLK | AdC | AdA | B2 | AdE | R1 | B1 | R2 | G1 | G2 | AdD | LAT | #26: AdB | RGB Matrix / Bonnet for / RaspberryPi | 5V OK | 5V In | 5V / Out | HUB75
bDocu: 5V | 3V | GND | E | #8 | #16
Pinguin_tBackup: Port 3 | Port 2 | 5 | Port 1 | 3 | Addr / E | G | 4 | 8 | Triple Output / HUB75/75E / RGB Matrix / Active3 Bonnet | I2C
Pinguin_bBackup: G1:2/SCL | E4 | G2: / 16 | E8 | B | D | LAT | GND | G1: / 5 | E4 | G2: / 13 | E8 | B | D | LAT | GND | R1:14/TxD | B1:3/SDA | R2:26 | B2:21 | ADDR A | ADDR C | CLK | OE | R1:12 | B1:6 | R2:19 | B2:20 | ADDR A | C | OE | CLK | G1:27 | E4 | G2:9 | E8 | ADDR B | ADDR D | LAT | GND | Addr A: 22 / Addr B: 23 / Addr C: 24 / Addr D: 25 / Addr E: 15/RxD | OE: 18 / Clock: 17 / Latch: 4 | R1: | B1: | R2: | B2: | A | C | CLK | OE | 11 | 7 | 8 | 10